# EAGLE design CAN通信 (EAGLE 7.4.0)
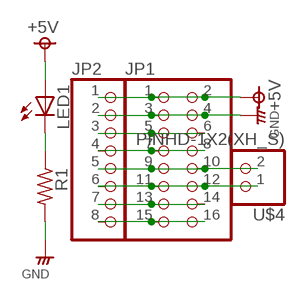
[diagram p0: schematic, sheet 1]

## Parts
JP1  PINHD-2X8  [2X08]
JP2  PINHD-1X8  [1X08]
LED1  LED3MM  [LED3MM]
R1  RESISTORS-3  [R_0.3]
U$4  PINHD-1X2(XH_S)  [1X2(XH-S)]

## Nets
+5V: JP1.1 JP1.2 JP2.1 LED1.A
GND: JP1.3 JP1.4 JP2.2 R1.2
N$1: LED1.K(C) R1.1
N$3: JP1.5 JP1.6 JP2.3
N$4: JP1.7 JP1.8 JP2.4
N$5: JP1.9 JP1.10 JP2.5 U$4.2
N$6: JP1.11 JP1.12 JP2.6 U$4.1
N$7: JP1.13 JP1.14 JP2.7
N$8: JP1.15 JP1.16 JP2.8

## Library data of the parts
JP1 = pinhead_s:PINHD-2X8: PIN HEADER
JP2 = pinhead_s:PINHD-1X8: PIN HEADER
LED1 = LED_s:LED: LED OSRAM: - CHIPLED LG R971, LG N971, LY N971, LG Q971, LY Q971, LO R971, LY R971 LH N974, LH R974 LS Q976, LO Q976, LY Q976 LO Q996 - Hyper CHIPLED LW Q18S LB Q993, LB Q99A, LB R99A - SideLED LS A670, LO A670, LY A670, LG A670, LP A670 LB A673, LV A673, LT A673, LW A673 LH A674 LY A675 LS A676, LA A676, LO A676, LY A676, LW A676 LS A679, LY A679, LG A679 - Hyper Micro SIDELED® LS Y876, LA Y876, LO Y876, LY Y876 LT Y87S - SmartLED LW L88C, LW L88S LB L89C, LB L89S, LG L890 LS L89K, LO L89K, LY L89K LS L896, LA L896, LO L896, LY L896 - TOPLED LS T670, LO T670, LY T670, LG T670, LP T670 LSG T670, LSP T670, LSY T670, LOP T670, LYG T670 LG T671, LOG T671, LSG T671 LB T673, LV T673, LT T673, LW T673 LH T674 LS T676, LA T676, LO T676, LY T676, LB T676, LH T676, LSB T676, LW T676 LB T67C, LV T67C, LT T67C, LS T67K, LO T67K, LY T67K, LW E67C LS E67B, LA E67B, LO E67B, LY E67B, LB E67C, LV E67C, LT E67C LW T67C LS T679, LY T679, LG T679 LS T770, LO T770, LY T770, LG T770, LP T770 LB T773, LV T773, LT T773, LW T773 LH T774 LS E675, LA E675, LY E675, LS T675 LS T776, LA T776, LO T776, LY T776, LB T776 LHGB T686 LT T68C, LB T68C - Hyper Mini TOPLED® LB M676 - Mini TOPLED Santana® LG M470 LS M47K, LO M47K, LY M47K Source: http://www.osram.convergy.de - LUMILED® LXK2-PW12-R00, LXK2-PW12-S00, LXK2-PW14-U00, LXK2-PW14-V00 LXK2-PM12-R00, LXK2-PM12-S00, LXK2-PM14-U00 LXK2-PE12-Q00, LXK2-PE12-R00, LXK2-PE12-S00, LXK2-PE14-T00, LXK2-PE14-U00 LXK2-PB12-K00, LXK2-PB12-L00, LXK2-PB12-M00, LXK2-PB14-N00, LXK2-PB14-P00, LXK2-PB14-Q00 LXK2-PR12-L00, LXK2-PR12-M00, LXK2-PR14-Q00, LXK2-PR14-R00 LXK2-PD12-Q00, LXK2-PD12-R00, LXK2-PD12-S00 LXK2-PH12-R00, LXK2-PH12-S00 LXK2-PL12-P00, LXK2-PL12-Q00, LXK2-PL12-R00 Source: www.luxeon.com
R1 = rcl__s:RESISTORS
U$4 = pinhead_s:PINHD-1X2(XH_S)

## Board
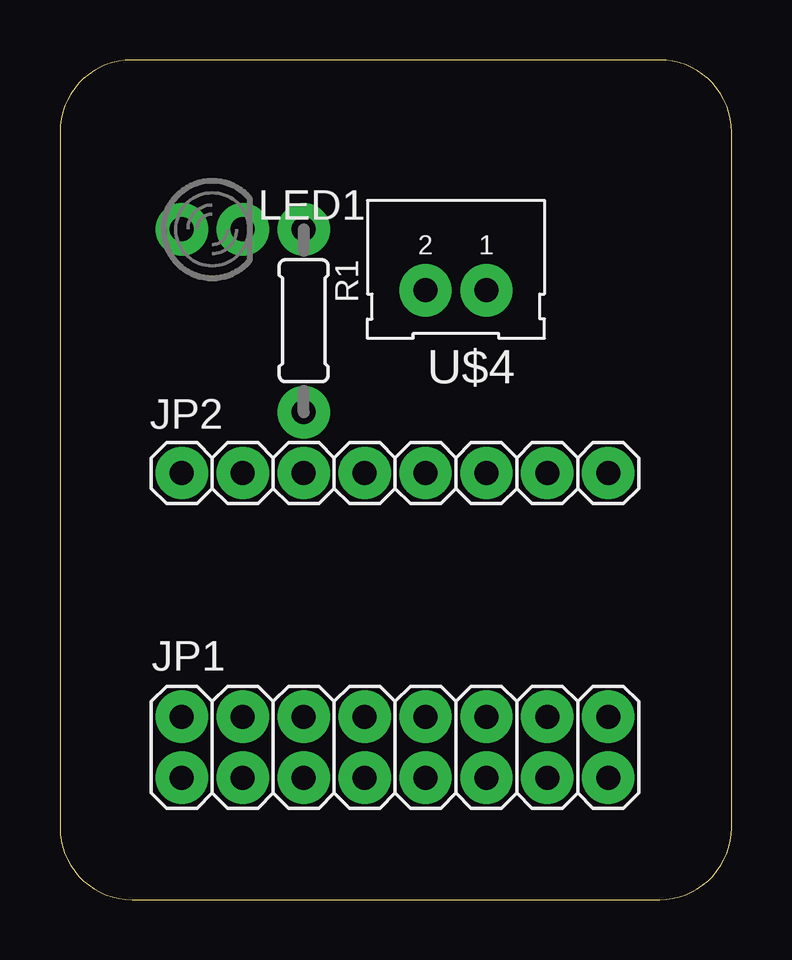
[diagram p1: board, top side]
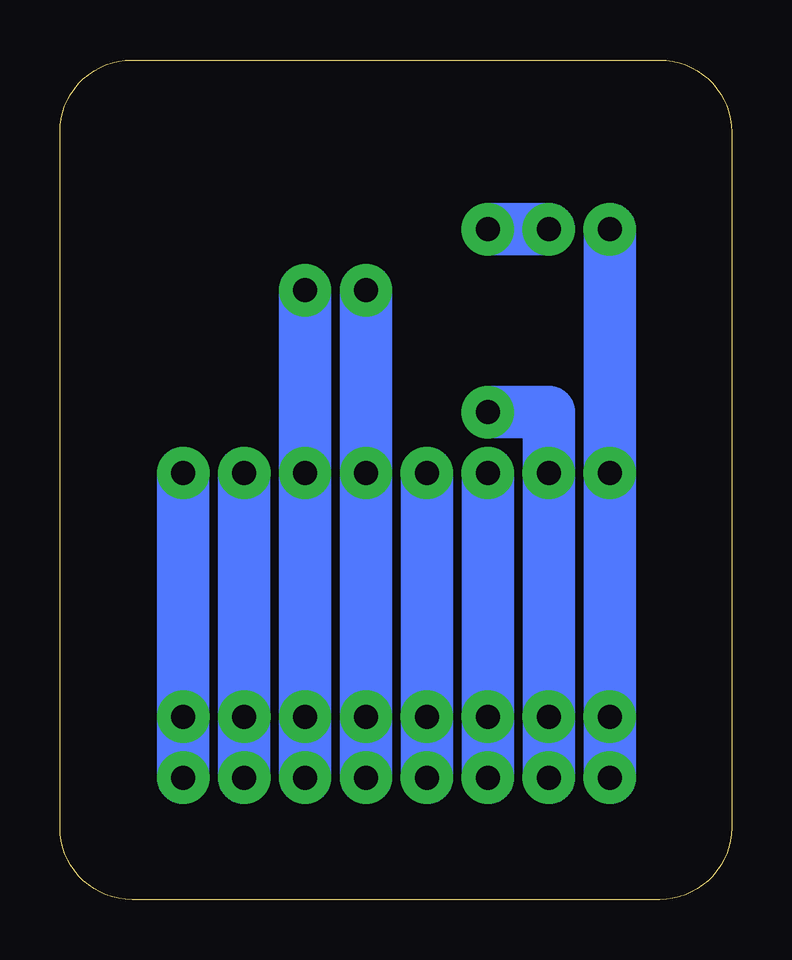
[diagram p2: board, bottom side, seen from below]

Size 28 x 35 mm. Coordinates in mm from the lower left corner, seen from the top.
Outline: 0,32 0,3 arc90 3,0 25,0 arc90 28,3 28,32 arc90 25,35 3,35 arc90 0,32
Copper layers (1*16): Top 0.035mm / dielectric 1.5mm / Bottom 0.035mm
Design rules "default": minimum track width 10mil, minimum drill 24mil, track to track 8mil, track to pad 8mil, pad to pad 8mil, via to via 8mil, smd to smd 8mil, copper to edge 40mil, drill to drill 8mil, minimum pad ring 10mil, minimum via ring 8mil, stop-mask expansion 4mil, vias tented up to drill 0mil, thermal gap 10mil

### Footprints (pad centres in the part's own frame; a part is rotated, then mirrored left to right if it is on the bottom)
2X08 = drill 1 pad 2.184: 1 -8.89,-1.27; 2 -8.89,1.27; 3 -6.35,-1.27; 4 -6.35,1.27; 5 -3.81,-1.27; 6 -3.81,1.27; 7 -1.27,-1.27; 8 -1.27,1.27; 9 1.27,-1.27; 10 1.27,1.27; 11 3.81,-1.27; 12 3.81,1.27; 13 6.35,-1.27; 14 6.35,1.27; 15 8.89,-1.27; 16 8.89,1.27
1X08 = drill 1 pad 2.184: 1 -8.89,0; 2 -6.35,0; 3 -3.81,0; 4 -1.27,0; 5 1.27,0; 6 3.81,0; 7 6.35,0; 8 8.89,0
LED3MM = drill 1 pad 2.184: A -1.27,0; K 1.27,0
R_0.3 = drill 1 pad 2.184: 1 -3.81,0; 2 3.81,0
1X2(XH-S) = drill 1 pad 2.184: 1 -6.35,0; 2 -3.81,0

### Placement (x,y rotation side)
JP1  13.97,6.35 0 top
JP2  13.97,17.78 0 top
LED1  6.35,27.94 0 top
R1  10.16,24.13 270 top
U$4  11.43,25.4 180 top

### Tracks (layer width: path | path; a pad name or v marks a point on that pad's centre or on a via)
+5V
  Bottom 2.184: JP1.1 JP1.2 JP2.1 LED1.A
GND
  Bottom 2.184: JP1.3 JP1.4 JP2.2 7.62,20.32 R1.2
N$1
  Bottom 2.184: LED1.K R1.1
N$3
  Bottom 2.184: JP1.5 JP1.6 JP2.3
N$4
  Bottom 2.184: JP2.4 JP1.8 JP1.7
N$5
  Bottom 2.184: JP1.9 JP1.10 JP2.5 U$4.2
N$6
  Bottom 2.184: JP1.11 JP1.12 JP2.6 U$4.1
N$7
  Bottom 2.184: JP1.13 JP1.14 JP2.7
N$8
  Bottom 2.184: JP2.8 JP1.16 JP1.15